# Altium schematic sheet Power & USB.SchDoc
size A4; SheetNumber: 5; SheetTotal: 5
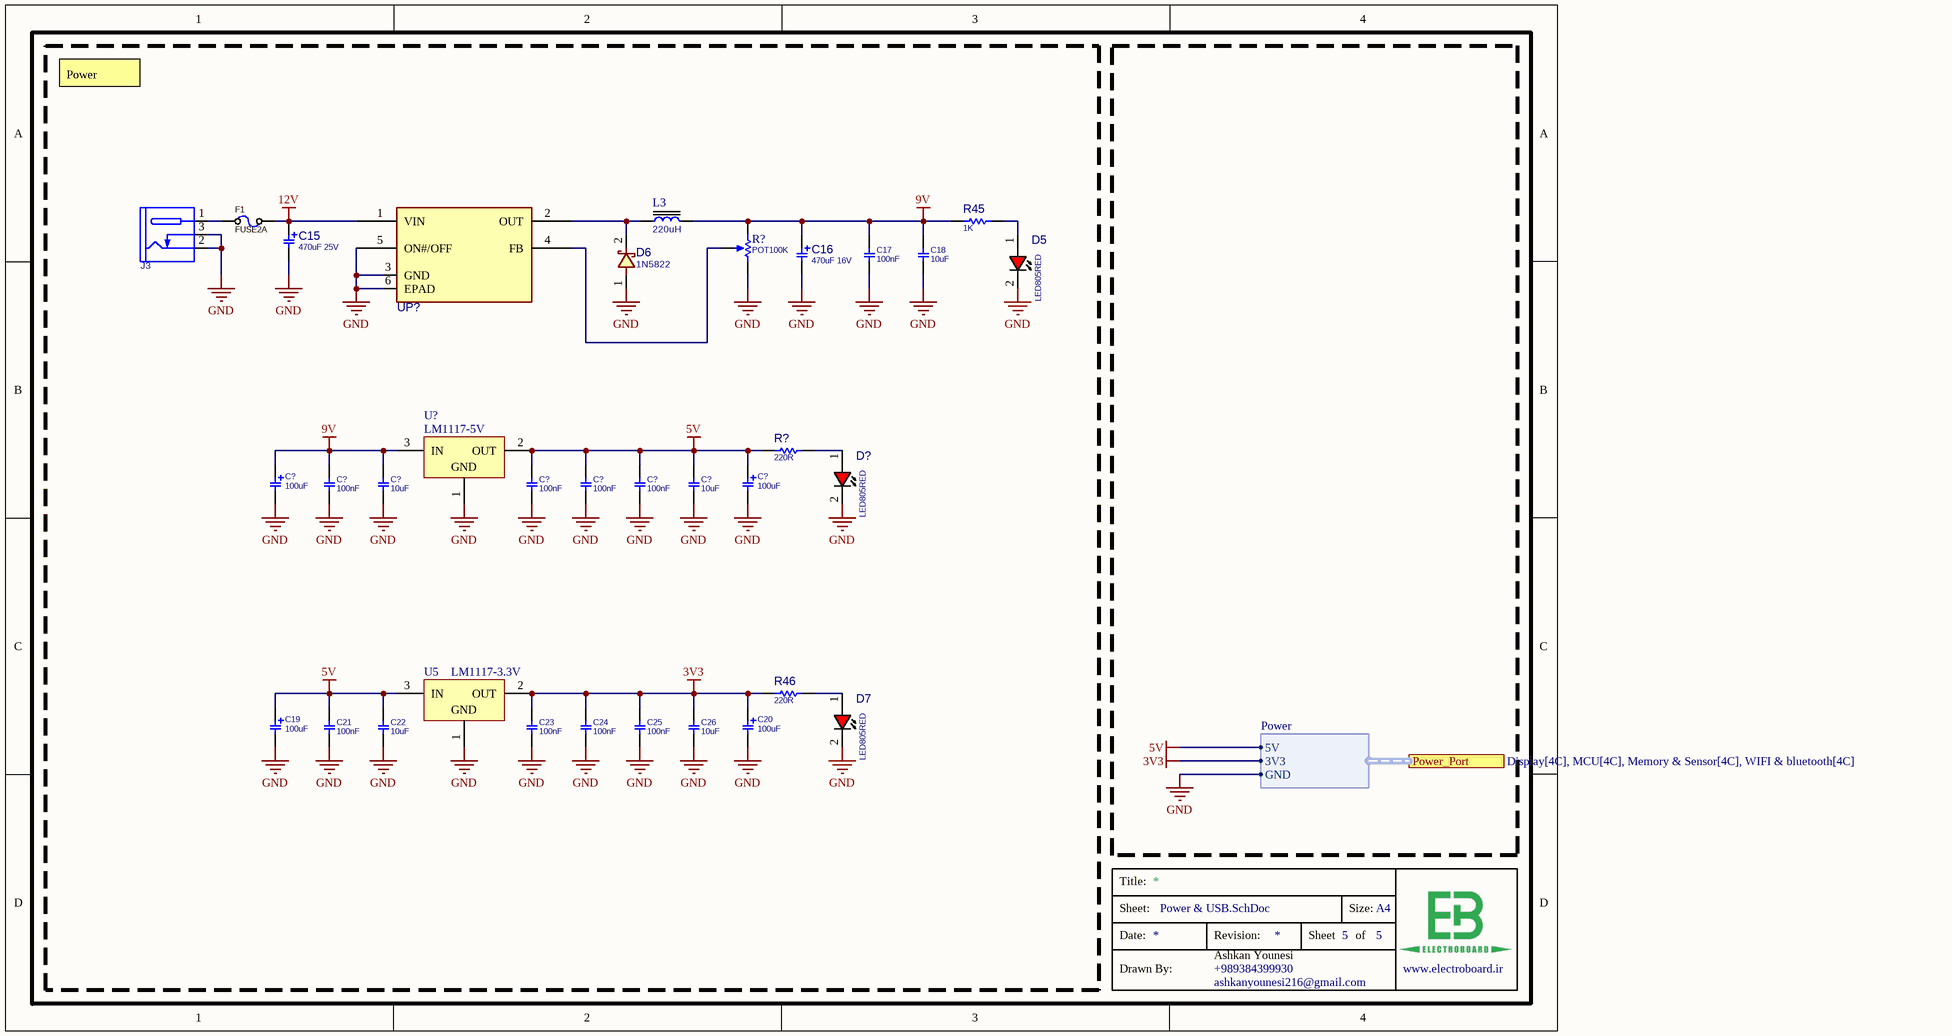
[diagram p0: Power & USB.SchDoc]

## Parts
(Parts that share a designator on the sheet are numbered #1, #2 ... from top to bottom, then left to right.)
C15  470uF 25V  [C_EL_8]
C16  470uF 16V  [C_EL_8]
C17  100nF  [C0603]
C18  10uF  [C0603]
C19  100uF  [C_TN_3216]
C20  100uF  [C_TN_3216]
C21  100nF  [C0805]
C22  10uF  [C0805]
C23  100nF  [C0805]
C24  100nF  [C0805]
C25  100nF  [C0805]
C26  10uF  [C0805]
C?#1  100uF  [C_TN_3216]
C?#2  100uF  [C_TN_3216]
C?#3  100nF  [C0805]
C?#4  10uF  [C0805]
C?#5  100nF  [C0805]
C?#6  100nF  [C0805]
C?#7  100nF  [C0805]
C?#8  10uF  [C0805]
D5  LED805RED  [LED0805RED]
D6  1N5822  [D_SMA]
D7  LED805RED  [LED0805RED]
D?  LED805RED  [LED0805RED]
F1  FUSE2A  [F2920]
J3  DC_POWER_JACK  [JAC_PWR2]  (value not drawn)
L3  220uH  [L_12]
R45  1K  [R0603]
R46  220R  [R0603]
R?#1  POT100K  [POT_3296W]
R?#2  220R  [R0603]
U5  LM1117-3.3V  [LM1117_SMD_SOT-223_3.3V]
U?  LM1117-5V  [LM1117_SMD_SOT-223_3.3V]
UP?  LM2576S-ADJ  [D2PAK_5]  (value not drawn)

## Ports
Power_Port (harness POWER, see Display[4C], MCU[4C], Memory & Sensor[4C], WIFI & bluetooth[4C])

## Harnesses
Power: 5V, 3V3, GND

## Nets
3V3: C20.1 C23.2 C24.2 C25.2 C26.2 R46.2 U5.2(OUT) ; port Power_Port.3V3
5V: C19.1 C21.2 C22.2 C?#2.1 C?#5.2 C?#6.2 C?#7.2 C?#8.2 R?#2.2 U5.3(IN) U?.2(OUT) ; port Power_Port.5V
9V: C16.1 C17.2 C18.2 C?#1.1 C?#3.2 C?#4.2 L3.2 R45.2 R?#1.1(TOP) U?.3(IN)
12V: C15.1 F1.2 UP?.1(VIN)
GND: C15.2 C16.2 C17.1 C18.1 C19.2 C20.2 C21.1 C22.1 C23.1 C24.1 C25.1 C26.1 C?#1.2 C?#2.2 C?#3.1 C?#4.1 C?#5.1 C?#6.1 C?#7.1 C?#8.1 D5.2(CATHODE) D6.1 D7.2(CATHODE) D?.2(CATHODE) J3.2(SLEEVE) J3.3(INSERTION_DET) R?#1.3(BOT) U5.1(GND) U?.1(GND) UP?.3(GND) UP?.5(ON#/OFF) UP?.6(EPAD) ; port Power_Port.GND
NetD5_1: D5.1(ANODE) R45.1
NetD6_2: D6.2 L3.1 UP?.2(OUT)
NetD7_1: D7.1(ANODE) R46.1
NetD?_1: D?.1(ANODE) R?#2.1
NetF1_1: F1.1 J3.1(TIP)
NetR?#1_2: R?#1.2(TAP) UP?.4(FB)

## Notes on the sheet
- Power
- Title:
- Sheet:
- Size:
- A4
- Drawn By:
- Date:
- Revision:
- Ashkan Younesi
- ashkanyounesi216@gmail.com
- +989384399930
- Sheet
- of
- www.electroboard.ir <http://www.electroboard.ir>

## Library data of the parts
C15 C16 = CAP_SMD_EL_330u25V: CAP, SMDD, ELEC, 330uF, 25V; MANF_P#: EEE-1EA331UP; PARAM2: 20%; MANF: PANASONIC; DESC: DESCRIPTION; DIST#: MOUSER; PRICE: 10= 5$; ASSEMBLY: ASSEMBLY; PARAM: 25V
  C15: VALUE: 470uF 25V
  C16: VALUE: 470uF 16V
C17 C18 = CAP_SMD_MLCC: CAP, MLCC, 1nF, 50V, C0G, 10%, 0402; DESC: CAP, MLCC, 100nF, 50V, C0G, 10%, 0402; MANF_P#: MANF_PART#; MANF: Murata; PARAM: C0G, 10%; PRICE: 100= 1$; PARAM2: 50V; ASSEMBLY: ASSEMBLY
  C17: VALUE: 100nF
  C18: VALUE: 10uF
C19 C20 C?#1 C?#2 = CAP_SMD_TAN_10uF_10V: CAP, SMD, TAN; PARAM: 20%, 300mOhm, -55~105oC; MANF: VISHAY; MANF_P#: T55A106M010C0300; PARAM2: 10V; PRICE: 0.46$; VALUE: 100uF
C21-C26 C?#3-C?#8 = CAP_SMD_MLCC_0805: CAP, MLCC, -F, -V, MATERIAL, -%, 0201; PARAM: -, -%; MANF_P#: MANF_PART#; PRICE: 100= 1$; MANF: -; PARAM2: -V; ASSEMBLY: ASSEMBLY
  C21 C23-C25 C?#3 C?#5-C?#7: VALUE: 100nF
  C22 C26 C?#4 C?#8: VALUE: 10uF
D5 D7 D? = LED_SMD_0805_RED: LED, SMD, 0805, RED; DESC: DESCRIPTION; MANF_P#: MANF_PART#; PARAM2: 2.2V; MANF: MANF; ASSEMBLY: ASSEMBLY; PRICE: 36t@Javan; VALUE: LED805RED
D6 = DIODE_SMD_SCHOTTKY_1N5822: DIODE, SCHOTTKY, 40V, 3A; MANF: DIODES; DESC: DESCRIPTION; MANF_P#: 1N5822; ASSEMBLY: ASSEMBLY; PRICE: PRICE; PARAM2: 3A; PARAM: 40V; VALUE: 1N5822
F1 = FUSE_PPTC2A_2920: Fuse, PPTC, 2A, 24v, 120mOhm, 2920; PARAM: 2A, 4A Itrip, 100A max, -40~85oC; MANF: Bel Fuse; MANF_P#: 0ZCF0200AF2C; PARAM2: 24VDC, 120mOhm; DESC: Resettable Fuse; PRICE: 0.23$; VALUE: FUSE2A
J3 = CONN_PWR_JACKR2: CONN, PWR JACK DC, PLUG DIAM 2.0MM RA THD; MANF: CUI STACK; MANF_P#: PJ-202A, PJ-002AH, PJ-102AH, KLDX-0202; VALUE: DC_POWER_JACK
L3 = INDPWR_SMD: INDUCTOR, POWER, SMD; VALUE: 220uH
R45 R46 R?#2 = RES_SMD: RESISTOR, SMD; PARAM: -W; DESC: DESCRIPTION; DIST#: MOUSER; PARAM2: 1%; MANF_P#: -; MANF: -; ASSEMBLY: ASSEMBLY; PRICE: 100= 0.5$
  R45: VALUE: 1K
  R46 R?#2: VALUE: 220R
R?#1 = RES_THD_POT_MULTITURN: RESISTOR, THD, Potentiometer Multiturn, most Popular; VALUE: POT100K
U5 U? = LM1117_SMD_SOT-223
UP? = VREG_LM2576S-ADJ_D2PAK: REG, Switching, Buck, 3A, ADJ, 50KHz, TO-220; MANF: TI, ON, HTC, MICROCHIP; PARAM: 3A, ADJ; PARAM2: 50KHz, 40VIN; ASSEMBLY: ASSEMBLY; PRICE: PRICE; DESC: REG, Switching, Buck, 3A, ADJ, 50KHz, TO-220; MANF_P#: LM2576S-ADJ; VALUE: LM2576S-ADJ; PACKAGE: D2PAK-5 (TO-263-5)